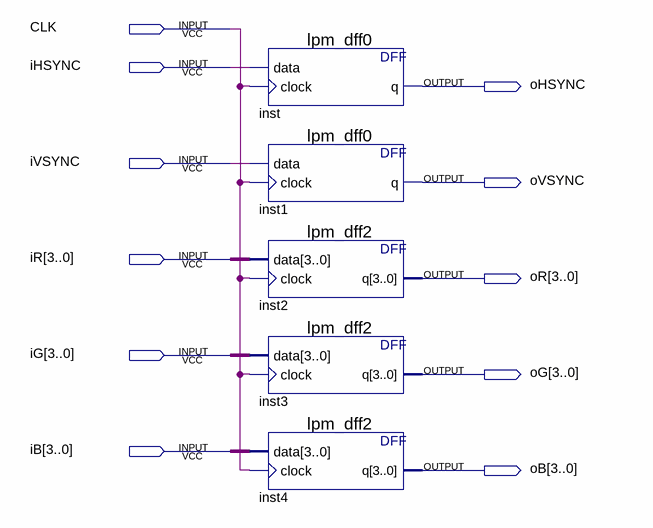
[diagram p0: schematic sheet]
// Quartus schematic VIDEO_FILTER.bdf as structural Verilog: 5 symbols, 11 pins
module VIDEO_FILTER (
  input  CLK,
  input  iHSYNC,
  input  iVSYNC,
  input  [3:0] iR,
  input  [3:0] iG,
  input  [3:0] iB,
  output oHSYNC,
  output oVSYNC,
  output [3:0] oR,
  output [3:0] oG,
  output [3:0] oB
);

  lpm_dff0 inst (.data(iHSYNC), .clock(CLK), .q(oHSYNC));
  lpm_dff0 inst1 (.data(iVSYNC), .clock(CLK), .q(oVSYNC));
  lpm_dff2 inst2 (.data(iR), .clock(CLK), .q(oR));
  lpm_dff2 inst3 (.data(iG), .clock(CLK), .q(oG));
  lpm_dff2 inst4 (.data(iB), .clock(CLK), .q(oB));
endmodule
